# Altium project Apalis Evaluation Board.PrjPCB (part 5 of 5)

## Sheet DVI-I.SchDoc: Apalis Evaluation Board 1.1
size A3; Organization: Toradex AG; Address1: Altsagenstrasse 5; Address2: Horw; Address3: 6048; Address4: Switzerland; DocumentNumber: 21; Revision: V1.1; SheetNumber: 21; SheetTotal: 32; PageSetup: Record=PageOptions|CenterHorizontal=True|CenterVertical=True|PrintScale=0.71|XCorrection=1.00|YCorrection=1.00|PrintKind=0|BorderSize=5000000|LeftOffset=0|BottomOffset=0|Orientation=2|PaperLength=1000|PaperWidth=1000|Scale=100|PaperSource=7|PrintQuality=-4|MediaType=1|DitherType=10|PaperKind=A4|PrintScaleMode=1
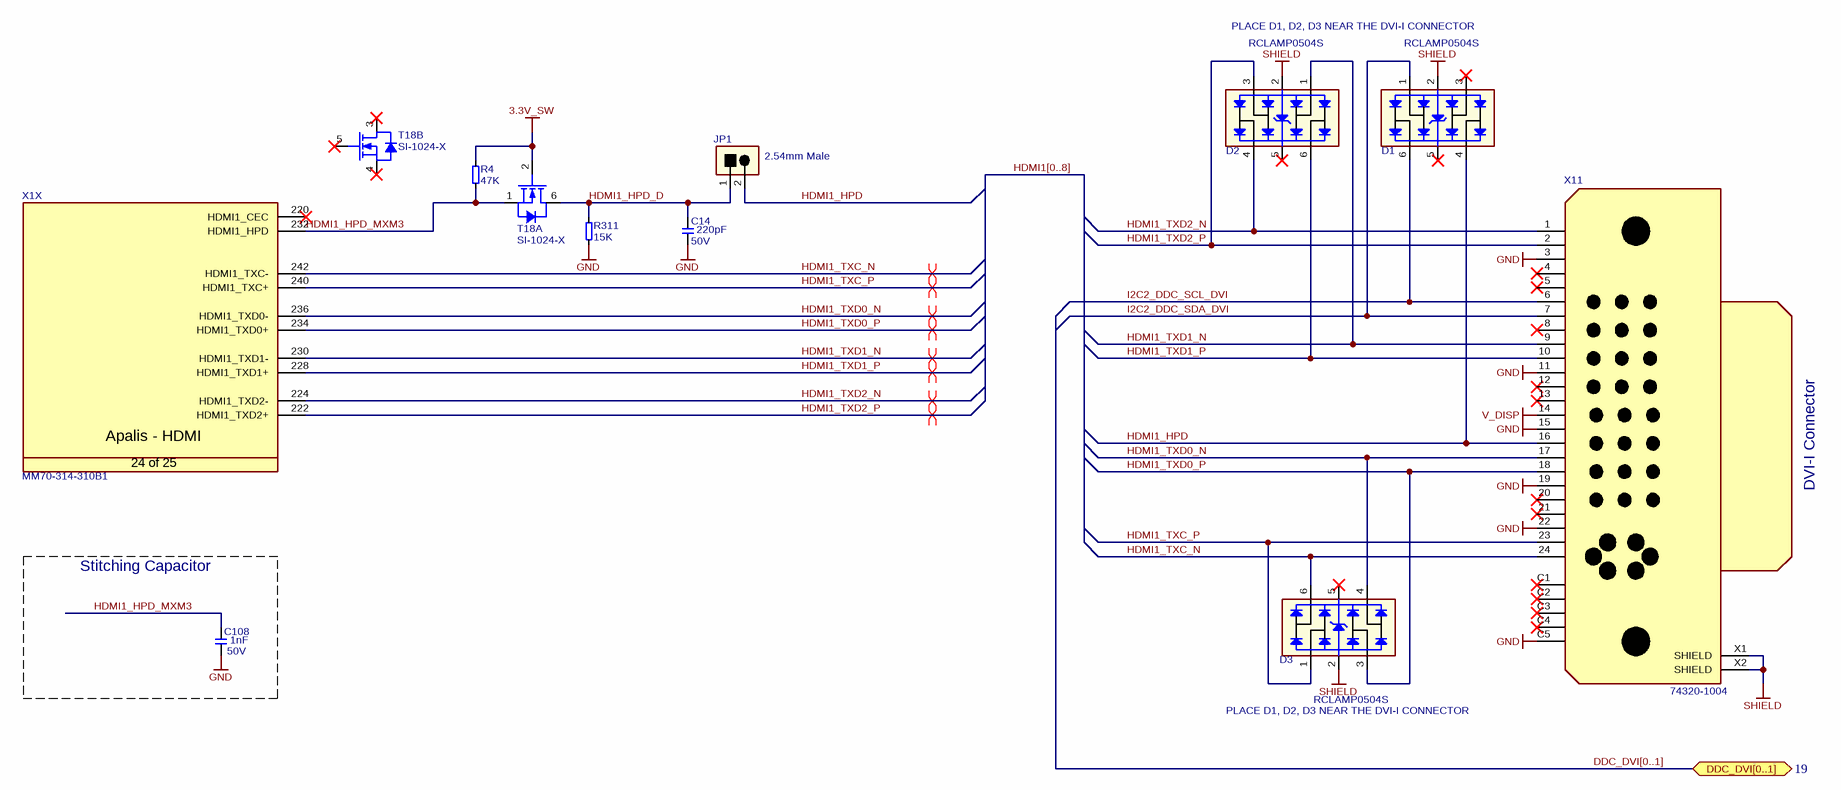
[diagram p27: DVI-I.SchDoc]

### Parts
C14  Rating: 50V  [T_CAPC0603X33N]  (hidden comment: 220pF)
C108  Rating: 50V  [CAPC1005X60N]  (hidden comment: 1nF)
D1  RCLAMP0504S  [T_SOT95P285X90-6N]
D2  RCLAMP0504S  [T_SOT95P285X90-6N]
D3  RCLAMP0504S  [T_SOT95P285X90-6N]
JP1  TSW-101-07-G-D  [T_Samtec_TSW-101-07-G-D]  (value not drawn)
R4  47K  [T_RESC0603X30N]
R311  15K  [T_RESC0603X30N]
T18  Manufacturer Part No.: SI-1024-X  [SOTFL50P160X60-6N]  (hidden comment: T-Vishay-SI-1024X-N)  (parts A,B of 2)
X1  Manufacturer Part No.: MM70-314-310B1  [T_JAE_MM70-314-310B1]  (hidden comment: CON-JAE-MM70-314-310B1-314-0.5mm)  (part X of 25)
X11  Manufacturer Part No.: 74320-1004  [T_MOLEX_74320-1004]  (hidden comment: CON-Molex-74320-1004-31)

### Blocks framed on the sheet
Stitching Capacitor: C108

### Ports
DDC_DVI[0..1] (bidir, see 19)

### Nets
3.3V_SW: R4.2 T18.2(G)
GND: C14.2 C108.1 R311.1 X11.3(GND) X11.11(GND) X11.15(GND) X11.19(GND) X11.22(GND) X11.C5(GND)
SHIELD: D1.2 D2.2 D3.2 X11.X1(SHIELD) X11.X2(SHIELD)
V_DISP: X11.14(VDD_DVI)
HDMI1_HPD: D1.4 JP1.2 X11.16(HOTPLUG_DETECT)
HDMI1_HPD_D: C14.1 JP1.1 R311.2 T18.6(D)
HDMI1_HPD_MXM3: C108.2 R4.1 T18.1(S) X1.232(HDMI1_HPD)
HDMI1_TXC_N: D3.6 X1.242(HDMI1_TXC-) X11.24(TMDS_CLK_N)
HDMI1_TXC_P: D3.1 X1.240(HDMI1_TXC+) X11.23(TMDS_CLK_P)
HDMI1_TXD0_N: D3.4 X1.236(HDMI1_TXD0-) X11.17(TMDS_DATA0_N)
HDMI1_TXD0_P: D3.3 X1.234(HDMI1_TXD0+) X11.18(TMDS_DATA0_P)
HDMI1_TXD1_N: D2.1 X1.230(HDMI1_TXD1-) X11.9(TMDS_DATA1_N)
HDMI1_TXD1_P: D2.6 X1.228(HDMI1_TXD1+) X11.10(TMDS_DATA1_P)
HDMI1_TXD2_N: D2.4 X1.224(HDMI1_TXD2-) X11.1(TMDS_DATA2_N)
HDMI1_TXD2_P: D2.3 X1.222(HDMI1_TXD2+) X11.2(TMDS_DATA2_P)
I2C2_DDC_SCL_DVI: D1.6 X11.6(DDC_CLK)
I2C2_DDC_SDA_DVI: D1.1 X11.7(DDC_DATA)

Not connected (* = marked no-connect by the designer): D1 3* 5*; D2 5*; D3 5*; T18 3(D)* 4(S)* 5(G)*; X1 220(HDMI1_CEC)*; X11 4(TMDS_DATA4_N)* 5(TMDS_DATA4_P)* 8(CRT_VSYNC)* 12(TMDS_DATA3_N)* 13(TMDS_DATA3_P)* 20(TMDS_DATA5_N)* 21(TMDS_DATA5_P)* C1(CRT_RED)* C2(CRT_GREEN)* C3(CRT_BLUE)* C4(CRT_HSYNC)*

### Buses and harness runs
bus DDC_DVI[0..1] = port DDC_DVI[0..1]
bus HDMI1[0..8]

### Layout directives
differential pair: HDMI1_TXC_N, HDMI1_TXC_P, HDMI1_TXD0_N, HDMI1_TXD0_P, HDMI1_TXD1_N, HDMI1_TXD1_P, HDMI1_TXD2_N, HDMI1_TXD2_P

### Notes on the sheet
- PLACE D1, D2, D3 NEAR THE DVI-I CONNECTOR
- (near JP1) 2.54mm Male
- DVI-I Connector
- (near D3) PLACE D1, D2, D3 NEAR THE DVI-I CONNECTOR
- Title
- Size:
- Date:
- A3
- Number:
- Time:
- Revision:
- Sheet
- of
- File:
- (in symbol CON-JAE-MM70-314-310B1-314-0.5mm, part X) Apalis - HDMI; 24 of 25

### Library data of the parts
C14 = C-X7R-220pF-50V-20%-0603: Capacitor Ceramic X7R 220pF 50V 20% 0603; Tolerance: 20%; Type: X7R; Value: 220pF
C108 = C-X7R-1nF-50V-10%-0402: Capacitor Ceramic X7R 1nF 50V 10% 0402; Tolerance: 10%; Type: X7R; Value: 1nF
D1-D3 = D-Semtech-RClamp0504S: TVS Array low cap; Manufacturer Name: Semtech; Manufacturer Part No.: RCLAMP0504S
JP1 = CON-Samtec-TSW-101-07-G-D: Header male, 1x2 Pins, 2.54 mm pitch; Manufacturer Name: Samtec; Pitch: 2.54 mm; No. of ways: 1x2; Manufacturer Part no.: TSW-101-07-G-D
R4 = R-47KR-63mW-5%-0603: Resistor 47 Kohm 63mW 5% 0603; Value: 47KR; Rating: 63mW; Tolerance: 5%
R311 = R-15KR-63mW-5%-0603: Resistor 15 Kohm 63mW 5% 0603; Value: 15KR; Rating: 63mW; Tolerance: 5%
T18 = T-Vishay-SI-1024X-N: Dual N-Channel 20V (D-S)  MOSFET; Manufacturer Name: Vishay
X1 = CON-JAE-MM70-314-310B1-314-0.5mm: MXM3 Connector; Manufacturer Name: JAE; No. of ways: 314
X11 = CON-Molex-74320-1004-31: DVI Connector; Manufacturer Name: Molex; No. of ways: 31

## Sheet Revision_History.SchDoc: Apalis Evaluation Board 1.1
size A3; Organization: Toradex AG; Address1: Altsagenstrasse 5; Address2: Horw; Address3: 6048; Address4: Switzerland; DocumentNumber: 1; Revision: V1.1; SheetNumber: 1; SheetTotal: 32; PageSetup: Record=PageOptions|CenterHorizontal=True|CenterVertical=True|PrintScale=0.73|XCorrection=1.00|YCorrection=1.00|PrintKind=0|BorderSize=5000000|LeftOffset=0|BottomOffset=0|Orientation=2|PaperLength=1000|PaperWidth=1000|Scale=100|PaperSource=7|PrintQuality=-4|MediaType=1|DitherType=10|PaperKind=A4|PrintScaleMode=1
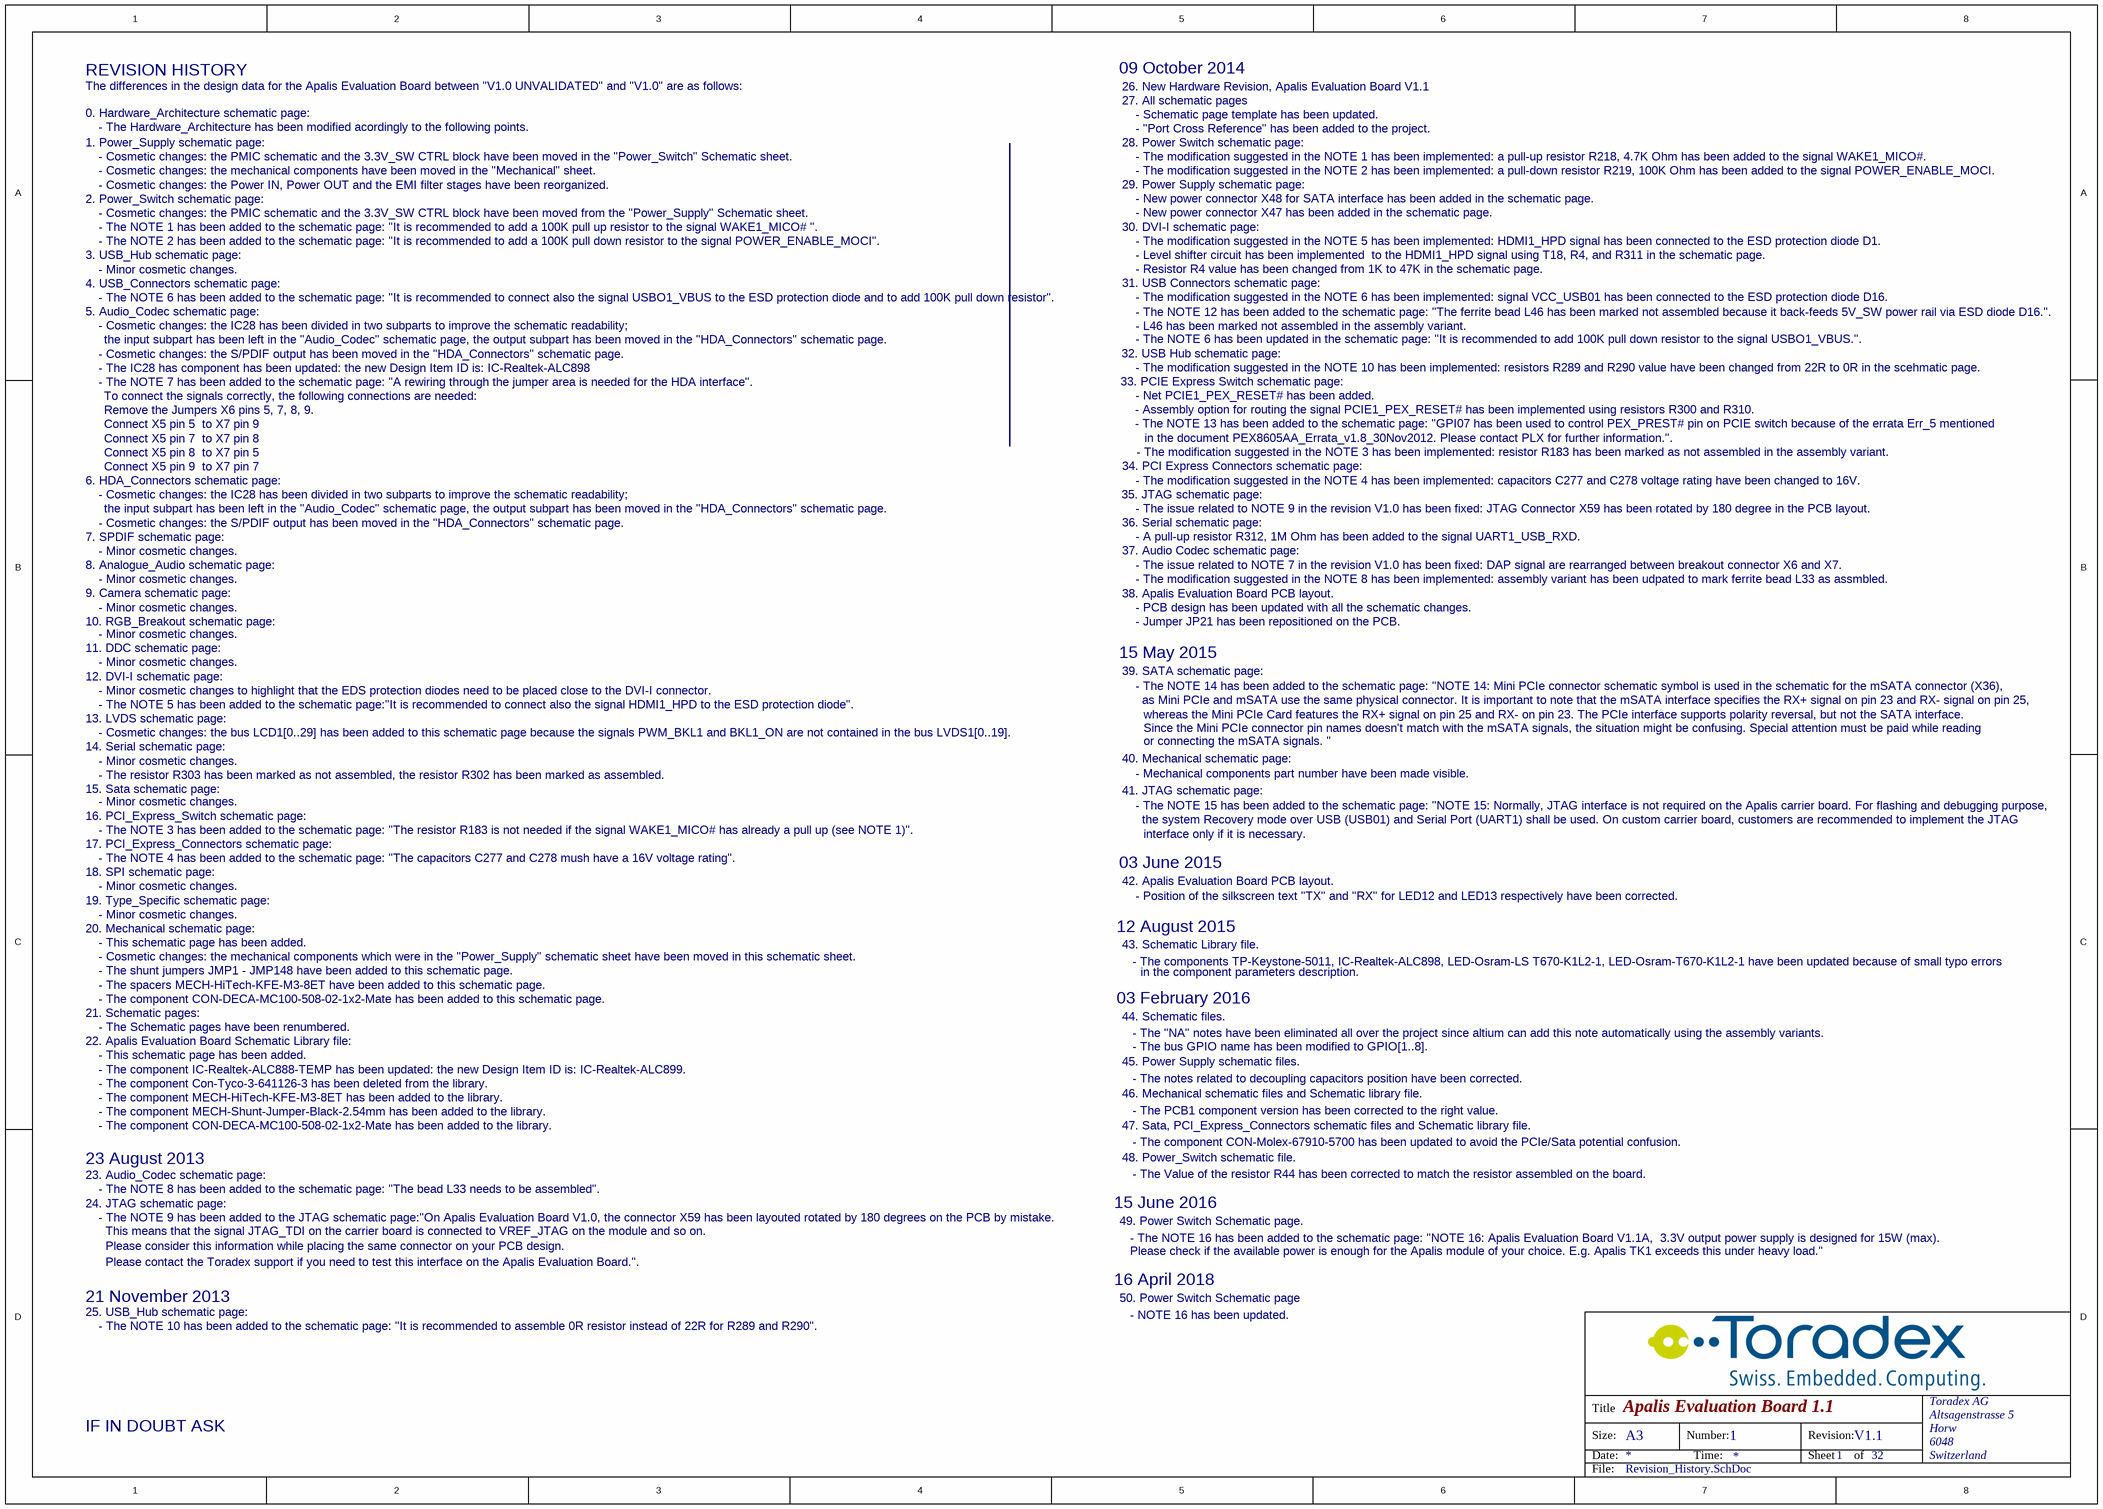
[diagram p28: Revision_History.SchDoc]

### Notes on the sheet
- The differences in the design data for the Apalis Evaluation Board between "V1.0 UNVALIDATED" and "V1.0" are as follows:
- REVISION HISTORY
- 09 October 2014
- 27. All schematic pages
- 26. New Hardware Revision, Apalis Evaluation Board V1.1
- 1. Power_Supply schematic page:
- 0. Hardware_Architecture schematic page:
- - Cosmetic changes: the PMIC schematic and the 3.3V_SW CTRL block have been moved in the "Power_Switch" Schematic sheet.
- - The Hardware_Architecture has been modified acordingly to the following points.
- - Cosmetic changes: the mechanical components have been moved in the "Mechanical" sheet.
- 28. Power Switch schematic page:
- - The modification suggested in the NOTE 2 has been implemented: a pull-down resistor R219, 100K Ohm has been added to the signal POWER_ENABLE_MOCI.
- - The modification suggested in the NOTE 1 has been implemented: a pull-up resistor R218, 4.7K Ohm has been added to the signal WAKE1_MICO#.
- - Schematic page template has been updated.
- - "Port Cross Reference" has been added to the project.
- 2. Power_Switch schematic page:
- - Cosmetic changes: the Power IN, Power OUT and the EMI filter stages have been reorganized.
- - Cosmetic changes: the PMIC schematic and the 3.3V_SW CTRL block have been moved from the "Power_Supply" Schematic sheet.
- - The NOTE 1 has been added to the schematic page: "It is recommended to add a 100K pull up resistor to the signal WAKE1_MICO# ".
- - The NOTE 2 has been added to the schematic page: "It is recommended to add a 100K pull down resistor to the signal POWER_ENABLE_MOCI".
- 30. DVI-I schematic page:
- 29. Power Supply schematic page:
- - New power connector X48 for SATA interface has been added in the schematic page.
- - The modification suggested in the NOTE 5 has been implemented: HDMI1_HPD signal has been connected to the ESD protection diode D1.
- - New power connector X47 has been added in the schematic page.
- 3. USB_Hub schematic page:
- 4. USB_Connectors schematic page:
- 5. Audio_Codec schematic page:
- - The NOTE 6 has been added to the schematic page: "It is recommended to connect also the signal USBO1_VBUS to the ESD protection diode and to add 100K pull down resistor".
- - Minor cosmetic changes.
- 31. USB Connectors schematic page:
- - Level shifter circuit has been implemented  to the HDMI1_HPD signal using T18, R4, and R311 in the schematic page.
- - Resistor R4 value has been changed from 1K to 47K in the schematic page.
- - The modification suggested in the NOTE 6 has been implemented: signal VCC_USB01 has been connected to the ESD protection diode D16.
- - The NOTE 12 has been added to the schematic page: "The ferrite bead L46 has been marked not assembled because it back-feeds 5V_SW power rail via ESD diode D16.".
- - Cosmetic changes: the IC28 has been divided in two subparts to improve the schematic readability;
- - Cosmetic changes: the S/PDIF output has been moved in the "HDA_Connectors" schematic page.
- - The IC28 has component has been updated: the new Design Item ID is: IC-Realtek-ALC898
- the input subpart has been left in the "Audio_Codec" schematic page, the output subpart has been moved in the "HDA_Connectors" schematic page.
- 33. PCIE Express Switch schematic page:
- 32. USB Hub schematic page:
- - L46 has been marked not assembled in the assembly variant.
- - The modification suggested in the NOTE 10 has been implemented: resistors R289 and R290 value have been changed from 22R to 0R in the scehmatic page.
- - The NOTE 6 has been updated in the schematic page: "It is recommended to add 100K pull down resistor to the signal USBO1_VBUS.".
- - The NOTE 7 has been added to the schematic page: "A rewiring through the jumper area is needed for the HDA interface".
- To connect the signals correctly, the following connections are needed:
- Remove the Jumpers X6 pins 5, 7, 8, 9.
- Connect X5 pin 7  to X7 pin 8
- Connect X5 pin 5  to X7 pin 9
- - Assembly option for routing the signal PCIE1_PEX_RESET# has been implemented using resistors R300 and R310.
- - The NOTE 13 has been added to the schematic page: "GPI07 has been used to control PEX_PREST# pin on PCIE switch because of the errata Err_5 mentioned
- - Net PCIE1_PEX_RESET# has been added.
- in the document PEX8605AA_Errata_v1.8_30Nov2012. Please contact PLX for further information.".
- 6. HDA_Connectors schematic page:
- Connect X5 pin 9  to X7 pin 7
- Connect X5 pin 8  to X7 pin 5
- 35. JTAG schematic page:
- 34. PCI Express Connectors schematic page:
- - The modification suggested in the NOTE 4 has been implemented: capacitors C277 and C278 voltage rating have been changed to 16V.
- - The issue related to NOTE 9 in the revision V1.0 has been fixed: JTAG Connector X59 has been rotated by 180 degree in the PCB layout.
- - The modification suggested in the NOTE 3 has been implemented: resistor R183 has been marked as not assembled in the assembly variant.
- 7. SPDIF schematic page:
- 8. Analogue_Audio schematic page:
- 36. Serial schematic page:
- 37. Audio Codec schematic page:
- - A pull-up resistor R312, 1M Ohm has been added to the signal UART1_USB_RXD.
- - The issue related to NOTE 7 in the revision V1.0 has been fixed: DAP signal are rearranged between breakout connector X6 and X7.
- - The modification suggested in the NOTE 8 has been implemented: assembly variant has been udpated to mark ferrite bead L33 as assmbled.
- 9. Camera schematic page:
- 10. RGB_Breakout schematic page:
- 11. DDC schematic page:
- 38. Apalis Evaluation Board PCB layout.
- - Jumper JP21 has been repositioned on the PCB.
- - PCB design has been updated with all the schematic changes.
- 12. DVI-I schematic page:
- 13. LVDS schematic page:
- - Minor cosmetic changes to highlight that the EDS protection diodes need to be placed close to the DVI-I connector.
- - The NOTE 5 has been added to the schematic page:"It is recommended to connect also the signal HDMI1_HPD to the ESD protection diode".
- 15 May 2015
- 39. SATA schematic page:
- - The NOTE 14 has been added to the schematic page: "NOTE 14: Mini PCIe connector schematic symbol is used in the schematic for the mSATA connector (X36),
- as Mini PCIe and mSATA use the same physical connector. It is important to note that the mSATA interface specifies the RX+ signal on pin 23 and RX- signal on pin 25,
- whereas the Mini PCIe Card features the RX+ signal on pin 25 and RX- on pin 23. The PCIe interface supports polarity reversal, but not the SATA interface.
- 14. Serial schematic page:
- - Cosmetic changes: the bus LCD1[0..29] has been added to this schematic page because the signals PWM_BKL1 and BKL1_ON are not contained in the bus LVDS1[0..19].
- - The resistor R303 has been marked as not assembled, the resistor R302 has been marked as assembled.
- 40. Mechanical schematic page:
- - Mechanical components part number have been made visible.
- Since the Mini PCIe connector pin names doesn't match with the mSATA signals, the situation might be confusing. Special attention must be paid while reading
- or connecting the mSATA signals. "
- 15. Sata schematic page:
- 16. PCI_Express_Switch schematic page:
- 17. PCI_Express_Connectors schematic page:
- - The NOTE 3 has been added to the schematic page: "The resistor R183 is not needed if the signal WAKE1_MICO# has already a pull up (see NOTE 1)".
- 41. JTAG schematic page:
- - The NOTE 15 has been added to the schematic page: "NOTE 15: Normally, JTAG interface is not required on the Apalis carrier board. For flashing and debugging purpose,
- the system Recovery mode over USB (USB01) and Serial Port (UART1) shall be used. On custom carrier board, customers are recommended to implement the JTAG
- interface only if it is necessary.
- 18. SPI schematic page:
- 19. Type_Specific schematic page:
- - The NOTE 4 has been added to the schematic page: "The capacitors C277 and C278 mush have a 16V voltage rating".
- 03 June 2015
- 42. Apalis Evaluation Board PCB layout.
- - Position of the silkscreen text "TX" and "RX" for LED12 and LED13 respectively have been corrected.
- 20. Mechanical schematic page:
- - This schematic page has been added.
- - Cosmetic changes: the mechanical components which were in the "Power_Supply" schematic sheet have been moved in this schematic sheet.
- - The shunt jumpers JMP1 - JMP148 have been added to this schematic page.
- - The spacers MECH-HiTech-KFE-M3-8ET have been added to this schematic page.
- 12 August 2015
- 43. Schematic Library file.
- - The components TP-Keystone-5011, IC-Realtek-ALC898, LED-Osram-LS T670-K1L2-1, LED-Osram-T670-K1L2-1 have been updated because of small typo errors
- in the component parameters description.
- 22. Apalis Evaluation Board Schematic Library file:
- 21. Schematic pages:
- - The Schematic pages have been renumbered.
- - The component CON-DECA-MC100-508-02-1x2-Mate has been added to this schematic page.
- 03 February 2016
- 44. Schematic files.
- - The "NA" notes have been eliminated all over the project since altium can add this note automatically using the assembly variants.
- - The bus GPIO name has been modified to GPIO[1..8].
- - The component IC-Realtek-ALC888-TEMP has been updated: the new Design Item ID is: IC-Realtek-ALC899.
- - The component Con-Tyco-3-641126-3 has been deleted from the library.
- - The component MECH-HiTech-KFE-M3-8ET has been added to the library.
- - The component MECH-Shunt-Jumper-Black-2.54mm has been added to the library.
- 45. Power Supply schematic files.
- 46. Mechanical schematic files and Schematic library file.
- - The notes related to decoupling capacitors position have been corrected.
- - The PCB1 component version has been corrected to the right value.
- 23 August 2013
- 23. Audio_Codec schematic page:
- - The component CON-DECA-MC100-508-02-1x2-Mate has been added to the library.
- - The NOTE 8 has been added to the schematic page: "The bead L33 needs to be assembled".
- 47. Sata, PCI_Express_Connectors schematic files and Schematic library file.
- 48. Power_Switch schematic file.
- - The component CON-Molex-67910-5700 has been updated to avoid the PCIe/Sata potential confusion.
- - The Value of the resistor R44 has been corrected to match the resistor assembled on the board.
- 24. JTAG schematic page:
- - The NOTE 9 has been added to the JTAG schematic page:"On Apalis Evaluation Board V1.0, the connector X59 has been layouted rotated by 180 degrees on the PCB by mistake.
- This means that the signal JTAG_TDI on the carrier board is connected to VREF_JTAG on the module and so on.
- Please consider this information while placing the same connector on your PCB design.
- 15 June 2016
- 49. Power Switch Schematic page.
- - The NOTE 16 has been added to the schematic page: "NOTE 16: Apalis Evaluation Board V1.1A,  3.3V output power supply is designed for 15W (max).
- Please check if the available power is enough for the Apalis module of your choice. E.g. Apalis TK1 exceeds this under heavy load."
- 21 November 2013
- 25. USB_Hub schematic page:
- - The NOTE 10 has been added to the schematic page: "It is recommended to assemble 0R resistor instead of 22R for R289 and R290".
- Please contact the Toradex support if you need to test this interface on the Apalis Evaluation Board.".
- 16 April 2018
- 50. Power Switch Schematic page
- - NOTE 16 has been updated.
- IF IN DOUBT ASK
- Title
- Size:
- Date:
- A3
- Number:
- Time:
- Revision:
- Sheet
- of
- File:

## Nets that join several sheets
3.3V: LEDs_Switches (8 pins), Power_Supply (8 pins), Power_Switch (18 pins), Type_Specific (X38.62 X38.64 X38.66 X38.68)
3.3V_SW: Analogue_Audio (IC1.3), Audio_Codec (C241.1 L30.1), Camera_Interface (6 pins), CAN (12 pins), Ethernet (X12.14 X12.16), HDA_Connectors (R234.1), LEDs_Switches (10 pins), PCI_Express_Connectors (17 pins), PCI_Express_Switch (59 pins), Power_Supply (29 pins), Power_Switch (7 pins), RGB_Displays (7 pins), RTC (R173.2 R175.2 R176.2 R177.2), Sata (19 pins), Type_Specific (X38.72 X38.74 X38.76 X38.78), USB_Connectors (R279.1 R294.2), USB_Hub (16 pins), DDC (C234.2 IC27.2 R207.2 R208.2), LVDS (L5.1), DVI-I (R4.2 T18.2)
5V_SW: Analogue_Audio (C13.2 IC1.1), Audio_Codec (C243.2 L31.1), Camera_Interface (C145.2 X22.24), CAN (C125.1 C130.1 IC12.3 IC15.3), HDA_Connectors (L66.2), Power_Supply (5 pins), Power_Switch (5 pins), RGB_Displays (JP14.3 L13.1), SPDIF (C313.1 X21.2), Type_Specific (5 pins), USB_Connectors (6 pins), DDC (D10.1 R204.2), VGA (C165.2 C167.2 IC22.5 IC23.5), LVDS (L4.1)
12V_FILT_UNREG: Power_Supply (C33.2 C34.2 L9.2), Power_Switch (11 pins)
12V_SW_UNREG: Power_Supply (F1.1), Power_Switch (6 pins)
12V_SW_UNREG_F: PCI_Express_Connectors (10 pins), Power_Supply (5 pins), Type_Specific (X38.82 X38.84 X38.86), LVDS (L3.1)
AGND: Analogue_Audio (13 pins), Analog_IOs (X14.2 X14.4 X14.6 X14.8), Power_Supply (X1.303 X1.304 X1.308 X1.313)
AGND2: Audio_Codec (10 pins), HDA_Connectors (27 pins)
AVCC: Analogue_Audio (C12.2 IC1.5 R88.2), Power_Supply (R24.1)
GND: Analogue_Audio (5 pins), Analog_IOs (8 pins), Audio_Codec (13 pins), Camera_Interface (C144.1 C145.1 X22.19 X22.20), CAN (10 pins), Ethernet (7 pins), JTAG (9 pins), LEDs_Switches (30 pins), PCI_Express_Connectors (48 pins), PCI_Express_Switch (90 pins), Power_Supply (112 pins), Power_Switch (55 pins), RGB_Displays (25 pins), RTC (7 pins), Sata (38 pins), SPDIF (C287.1 C313.2 R276.1 X21.1), Type_Specific (26 pins), USB_Connectors (32 pins), USB_Hub (25 pins), DDC (5 pins), VGA (21 pins), LVDS (15 pins), DVI-I (9 pins)
SHIELD: Analogue_Audio (X26.S1 X26.S2 X26.S3 X26.S4), Ethernet (X12.S1 X12.S2), HDA_Connectors (X27.S1 X27.S2 X27.S3 X27.S4), Power_Supply (L6.2), USB_Connectors (20 pins), VGA (D8.2 D9.2 X24.S1 X24.S2), DVI-I (5 pins)
V_DISP: DDC (D10.3 R205.1 R206.1), VGA (JP24.3), DVI-I (X11.14)
V_SUPPLY_FILT: Power_Supply (5 pins), Power_Switch (12 pins)
V_SUPPLY_FILT_F: Power_Supply (F2.2 X25.6), Type_Specific (X38.56 X38.58 X38.60)
VCC_INTRTC: Power_Supply (C31.2 X1.174), RTC (JP22.1)
VSTB: Power_Switch (8 pins), Type_Specific (X38.2)
AN1_TSWIP: Analog_IOs (R89.2), RGB_Displays (C104.2 JP26.1 X16.6)
BKL1_ON: RGB_Displays (X20.37 X23.3 X31.5), LVDS (X13.37)
CAM1_MCLK: Camera_Interface (RA9.7 X22.3), Type_Specific (X38.34)
CAM_MEZ_PIN24: Camera_Interface (X56.9 X57.A9), Type_Specific (X38.24)
CAM_MEZ_PIN26: Camera_Interface (X56.10 X57.A10), Type_Specific (X38.26)
CAM_MEZ_PIN28: Camera_Interface (X56.11 X57.A11), Type_Specific (X38.28)
CAM_MEZ_PIN30: Camera_Interface (X56.12 X57.A12), Type_Specific (X38.30)
DAP1_S/PDIF_OUT: HDA_Connectors (IC28.48), SPDIF (JP25.3)
GPIO1: GPIOs (X3.B10 X4.10), Type_Specific (X38.106)
GPIO2: GPIOs (X3.B9 X4.9), Type_Specific (X38.108)
GPIO3: GPIOs (X3.B8 X4.8), Type_Specific (X38.110)
GPIO4: GPIOs (X3.B7 X4.7), Type_Specific (X38.112)
GPIO5: GPIOs (X3.B6 X4.6), Type_Specific (X38.114)
GPIO6: GPIOs (X3.B5 X4.5), RGB_Displays (JP26.3), Type_Specific (X38.116)
GPIO7: GPIOs (X3.B4 X4.4), PCI_Express_Switch (R310.1), Type_Specific (X38.118)
GPIO8: GPIOs (X3.B3 X4.3), Power_Switch (JP20.3), Type_Specific (X38.120)
I2C1_SCL: PCI_Express_Connectors (R262.2 R263.2 R265.1), PCI_Express_Switch (R190.1), RGB_Displays (R273.1), RTC (IC21.6 R176.1 X9.B39 X10.39), Sata (R159.1), Type_Specific (X38.90), USB_Hub (R75.1)
I2C1_SDA: PCI_Express_Connectors (R260.2 R261.2 R266.1), PCI_Express_Switch (R188.1), RGB_Displays (R274.1), RTC (IC21.5 R175.1 X9.B40 X10.40), Sata (R160.1), Type_Specific (X38.92), USB_Hub (R73.1)
I2C2_DDC_SCL_DVI: DDC (X39.4), DVI-I (D1.6 X11.6)
I2C2_DDC_SCL_LVDS: DDC (X39.6), LVDS (X13.38)
I2C2_DDC_SCL_VGA: DDC (X39.2), VGA (D9.6 X24.15)
I2C2_DDC_SDA_DVI: DDC (X40.4), DVI-I (D1.1 X11.7)
I2C2_DDC_SDA_LVDS: DDC (X40.6), LVDS (X13.36)
I2C2_DDC_SDA_VGA: DDC (X40.2), VGA (D9.1 X24.12)
I2C_CAM1_SCL: Camera_Interface (R292.2 RA31.7 X22.15), Type_Specific (X38.38)
I2C_CAM1_SDA: Camera_Interface (R291.2 RA31.8 X22.16), Type_Specific (X38.42)
PCIE1A_CLK_N: PCI_Express_Connectors (X44.A14), PCI_Express_Switch (IC24.B21)
PCIE1A_CLK_P: PCI_Express_Connectors (X44.A13), PCI_Express_Switch (IC24.A24)
PCIE1A_RX_N: PCI_Express_Connectors (X44.A17), PCI_Express_Switch (IC24.B10)
PCIE1A_RX_P: PCI_Express_Connectors (X44.A16), PCI_Express_Switch (IC24.A11)
PCIE1A_TX_N: PCI_Express_Connectors (X44.B15), PCI_Express_Switch (C169.2)
PCIE1A_TX_P: PCI_Express_Connectors (X44.B14), PCI_Express_Switch (C168.2)
PCIE1B_CLK_N: PCI_Express_Connectors (X45.11), PCI_Express_Switch (IC24.A23)
PCIE1B_CLK_P: PCI_Express_Connectors (X45.13), PCI_Express_Switch (IC24.A22)
PCIE1B_RX_N: PCI_Express_Connectors (X45.23), PCI_Express_Switch (IC24.B47)
PCIE1B_RX_P: PCI_Express_Connectors (X45.25), PCI_Express_Switch (IC24.A55)
PCIE1B_TX_N: PCI_Express_Connectors (X45.31), PCI_Express_Switch (C173.2)
PCIE1B_TX_P: PCI_Express_Connectors (X45.33), PCI_Express_Switch (C172.2)
PCIE1C_CLK_N: PCI_Express_Connectors (X43.A14), PCI_Express_Switch (IC24.A21)
PCIE1C_CLK_P: PCI_Express_Connectors (X43.A13), PCI_Express_Switch (IC24.A20)
PCIE1C_RX_N: PCI_Express_Connectors (X43.A17), PCI_Express_Switch (IC24.A61)
PCIE1C_RX_P: PCI_Express_Connectors (X43.A16), PCI_Express_Switch (IC24.A62)
PCIE1C_TX_N: PCI_Express_Connectors (X43.B15), PCI_Express_Switch (C175.2)
PCIE1C_TX_P: PCI_Express_Connectors (X43.B14), PCI_Express_Switch (C174.2)
POWER_ENABLE_MOCI: Power_Switch (6 pins), Type_Specific (X38.100)
PWM_BKL1: RGB_Displays (X31.6), LVDS (X13.35)
RESET_MICO#: JTAG (R22.1), Power_Switch (5 pins), Type_Specific (X38.104)
RESET_MOCI#: PCI_Express_Connectors (R304.1 X45.22), PCI_Express_Switch (R300.1), Power_Switch (IC18.1 T10.2 X3.B26 X4.26), RGB_Displays (R82.1), Type_Specific (X38.102), USB_Hub (IC9.26)
SPI1_CLK: SPI (X9.B38 X10.38), Type_Specific (X38.20)
SPI1_CS: SPI (X9.B35 X10.35), Type_Specific (X38.14)
SPI1_MISO: SPI (X9.B37 X10.37), Type_Specific (X38.18)
SPI1_MOSI: SPI (X9.B36 X10.36), Type_Specific (X38.16)
SPI2_CLK: SPI (X9.B31 X10.31), Type_Specific (X38.6)
SPI2_CS: SPI (X9.B32 X10.32), Type_Specific (X38.8)
SPI2_MISO: SPI (X9.B34 X10.34), Type_Specific (X38.12)
SPI2_MOSI: SPI (X9.B33 X10.33), Type_Specific (X38.10)
USBH2A_D_N: USB_Connectors (L64.2), USB_Hub (IC9.1)
USBH2A_D_P: USB_Connectors (L64.1), USB_Hub (IC9.2)
USBH2A_EN: USB_Connectors (IC31.4), USB_Hub (IC9.12)
USBH2A_OC#: USB_Connectors (IC31.5), USB_Hub (IC9.13)
USBH2B_D_N: PCI_Express_Connectors (X45.36), USB_Hub (IC9.3)
USBH2B_D_P: PCI_Express_Connectors (X45.38), USB_Hub (IC9.4)
USBH2C_D_N: USB_Connectors (L59.2), USB_Hub (IC9.6)
USBH2C_D_P: USB_Connectors (L59.1), USB_Hub (IC9.7)
USBH2C_EN: USB_Connectors (IC31.3), USB_Hub (IC9.18)
USBH2C_OC#: USB_Connectors (IC31.8), USB_Hub (IC9.19)
USBH2D_D_N: USB_Connectors (L57.2), USB_Hub (IC9.8)
USBH2D_D_P: USB_Connectors (L57.1), USB_Hub (IC9.9)
USBH2D_EN: USB_Connectors (IC30.4), USB_Hub (IC9.20)
USBH2D_OC#: USB_Connectors (IC30.5), USB_Hub (IC9.21)
USBH3_D_N: USB_Connectors (L52.2), USB_Hub (X1.88)
USBH3_D_P: USB_Connectors (L52.1), USB_Hub (X1.86)
USBH4_D_N: USB_Connectors (L50.2), USB_Hub (X1.100)
USBH4_D_P: USB_Connectors (L50.1), USB_Hub (X1.98)
USBH4_SSRX_N: USB_Connectors (D17.2 X51.5), USB_Hub (X1.92)
USBH4_SSRX_P: USB_Connectors (D17.1 X51.6), USB_Hub (X1.94)
USBH4_SSTX_N: USB_Connectors (D18.2 X51.8), USB_Hub (X1.104)
USBH4_SSTX_P: USB_Connectors (D18.1 X51.9), USB_Hub (X1.106)
USBH_EN: USB_Connectors (IC32.3 IC32.4), USB_Hub (IC9.27 R70.2 X3.B31 X4.31)
USBH_OC#: USB_Connectors (IC32.5 IC32.8), USB_Hub (R301.2 X3.B32 X4.32)
USBO1_D_N: USB_Connectors (L43.2), USB_Hub (X1.76)
USBO1_D_P: USB_Connectors (L43.1), USB_Hub (X1.74)
USBO1_EN: USB_Connectors (IC30.3), USB_Hub (X3.B34 X4.34)
USBO1_ID: USB_Connectors (D16.1 R279.2 X49.4), USB_Hub (RA77.6)
USBO1_OC#: USB_Connectors (IC30.8 R294.1), USB_Hub (X3.B33 X4.33)
USBO1_SSRX_N: USB_Connectors (D14.2 X49.9), USB_Hub (X1.64)
USBO1_SSRX_P: USB_Connectors (D14.1 X49.10), USB_Hub (X1.62)
USBO1_SSTX_N: USB_Connectors (D15.2 X49.6), USB_Hub (X1.70)
USBO1_SSTX_P: USB_Connectors (D15.1 X49.7), USB_Hub (X1.68)
USBO1_VBUS: USB_Connectors (R278.1), USB_Hub (RA77.5)
WAKE1_MICO#: PCI_Express_Connectors (R258.2 R259.2 R267.1), PCI_Express_Switch (R184.1), Power_Switch (R218.2 X3.B24 X4.24), Type_Specific (X38.98)

## Assembly variants
Apalis Evaluation Board v01.0.001: not fitted C3 C8 C11 C70 C86 C134 C136 C137 C139 C142 C154 C155 C176 C243 C244 C245 C287 IC25 JP4 JP13 L8 L16 L31 L32 L33 MECH15 MECH16 MECH17 MECH18 MECH19 MECH20 MECH21 R22 R23 R28 R58 R60 R73 R74 R75 R77 R83 R84 R96 R102 R156 R157 R159 R160 R191 R192 R193 R194 R198 R200 R202 R260 R261 R262 R263 R265 R266 R276 R285 R293 R302 R306 X23 X25
Apalis Evaluation Board v01.0.003: not fitted C3 C8 C11 C69 C84 C134 C136 C137 C139 C142 C154 C155 C176 C243 C244 C245 C287 IC25 JP4 JP13 L8 L16 L31 L32 L33 R22 R23 R28 R58 R60 R73 R74 R75 R77 R83 R84 R96 R102 R156 R157 R159 R160 R191 R192 R193 R194 R198 R200 R202 R260 R261 R262 R263 R265 R266 R276 R285 R293 R303 R306 X23 X25
Apalis Evaluation Board v01.0.004: not fitted C3 C8 C11 C69 C84 C134 C136 C137 C139 C142 C154 C155 C176 C243 C244 C245 C287 IC25 JP4 JP13 L8 L16 L31 L32 R22 R23 R28 R58 R60 R73 R74 R75 R77 R83 R84 R96 R102 R156 R157 R159 R160 R191 R192 R193 R194 R198 R200 R202 R260 R261 R262 R263 R265 R266 R276 R285 R293 R303 R306 X23 X25
Apalis Evaluation Board v01.1.001: not fitted C3 C8 C11 C69 C84 C134 C136 C137 C139 C142 C154 C155 C176 C243 C244 C245 C287 IC25 JP4 JP13 L8 L16 L31 L32 L46 MECH36 MECH37 R22 R23 R28 R58 R60 R73 R74 R75 R77 R83 R84 R96 R102 R156 R157 R159 R160 R183 R191 R192 R193 R194 R198 R200 R202 R260 R261 R262 R263 R265 R266 R276 R285 R293 R300 R303 R306 X23 X25